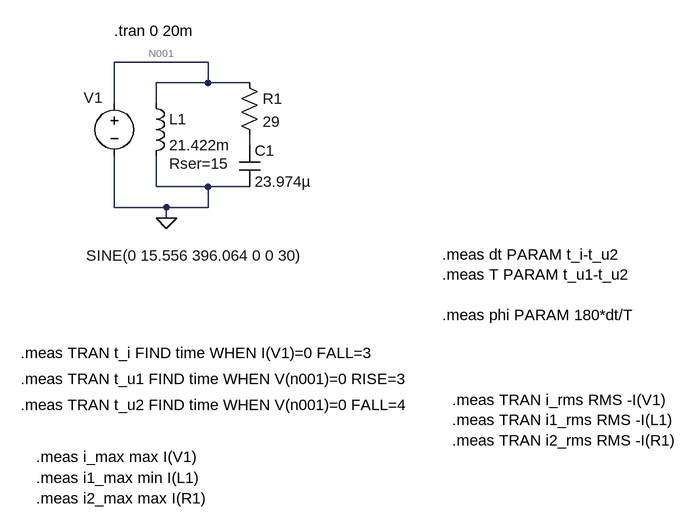
[diagram p0: schematic 2_9.asc]
2_9.asc, the LTspice schematic file:
Version 4.1
SHEET 1 1156 736
WIRE 320 16 176 16
WIRE 320 48 320 16
WIRE 320 48 240 48
WIRE 384 48 320 48
WIRE 176 80 176 16
WIRE 240 80 240 48
WIRE 384 144 384 128
WIRE 240 208 240 160
WIRE 320 208 240 208
WIRE 384 208 320 208
WIRE 176 240 176 160
WIRE 256 240 176 240
WIRE 320 240 320 208
WIRE 320 240 256 240
WIRE 256 256 256 240
FLAG 256 256 0
SYMBOL voltage 176 64 R0
WINDOW 123 0 0 Left 0
WINDOW 39 24 124 Left 2
WINDOW 0 -47 7 Left 2
WINDOW 3 -43 250 Left 2
SYMATTR InstName V1
SYMATTR Value SINE(0 15.556 396.064 0 0 30)
SYMBOL res 368 32 R0
SYMATTR InstName R1
SYMATTR Value 29
SYMBOL ind 224 64 R0
WINDOW 39 36 108 Left 2
SYMATTR SpiceLine Rser=15
SYMATTR InstName L1
SYMATTR Value 21.422m
SYMBOL cap 368 144 R0
SYMATTR InstName C1
SYMATTR Value 23.974µ
TEXT 176 -32 Left 2 !.tran 0 20m
TEXT 32 464 Left 2 !.meas TRAN t_i FIND time WHEN I(V1)=0 FALL=3
TEXT 32 504 Left 2 !.meas TRAN t_u1 FIND time WHEN V(n001)=0 RISE=3
TEXT 32 544 Left 2 !.meas TRAN t_u2 FIND time WHEN V(n001)=0 FALL=4
TEXT 56 624 Left 2 !.meas i_max max I(V1)
TEXT 56 656 Left 2 !.meas i1_max min I(L1)
TEXT 56 688 Left 2 !.meas i2_max max I(R1)
TEXT 680 312 Left 2 !.meas dt PARAM t_i-t_u2\n.meas T PARAM t_u1-t_u2\n \n.meas phi PARAM 180*dt/T
TEXT 696 536 Left 2 !.meas TRAN i_rms RMS -I(V1)\n.meas TRAN i1_rms RMS -I(L1)\n.meas TRAN i2_rms RMS -I(R1)

The netlist it stands for:
* 2_9.asc
V1 N001 0 SINE(0 15.556 396.064 0 0 30)
R1 N001 N002 29
L1 N001 0 21.422m Rser=15
C1 N002 0 23.974µ
.tran 0 20m
.meas TRAN t_i FIND time WHEN I(V1)=0 FALL=3
.meas TRAN t_u1 FIND time WHEN V(n001)=0 RISE=3
.meas TRAN t_u2 FIND time WHEN V(n001)=0 FALL=4
.meas i_max max I(V1)
.meas i1_max min I(L1)
.meas i2_max max I(R1)
.meas dt PARAM t_i-t_u2
.meas T PARAM t_u1-t_u2
.meas phi PARAM 180*dt/T
.meas TRAN i_rms RMS -I(V1)
.meas TRAN i1_rms RMS -I(L1)
.meas TRAN i2_rms RMS -I(R1)
.backanno
.end